# EAGLE design GPS_radiologger_v24_L70_CMWX_MAX (EAGLE 9.6.2)
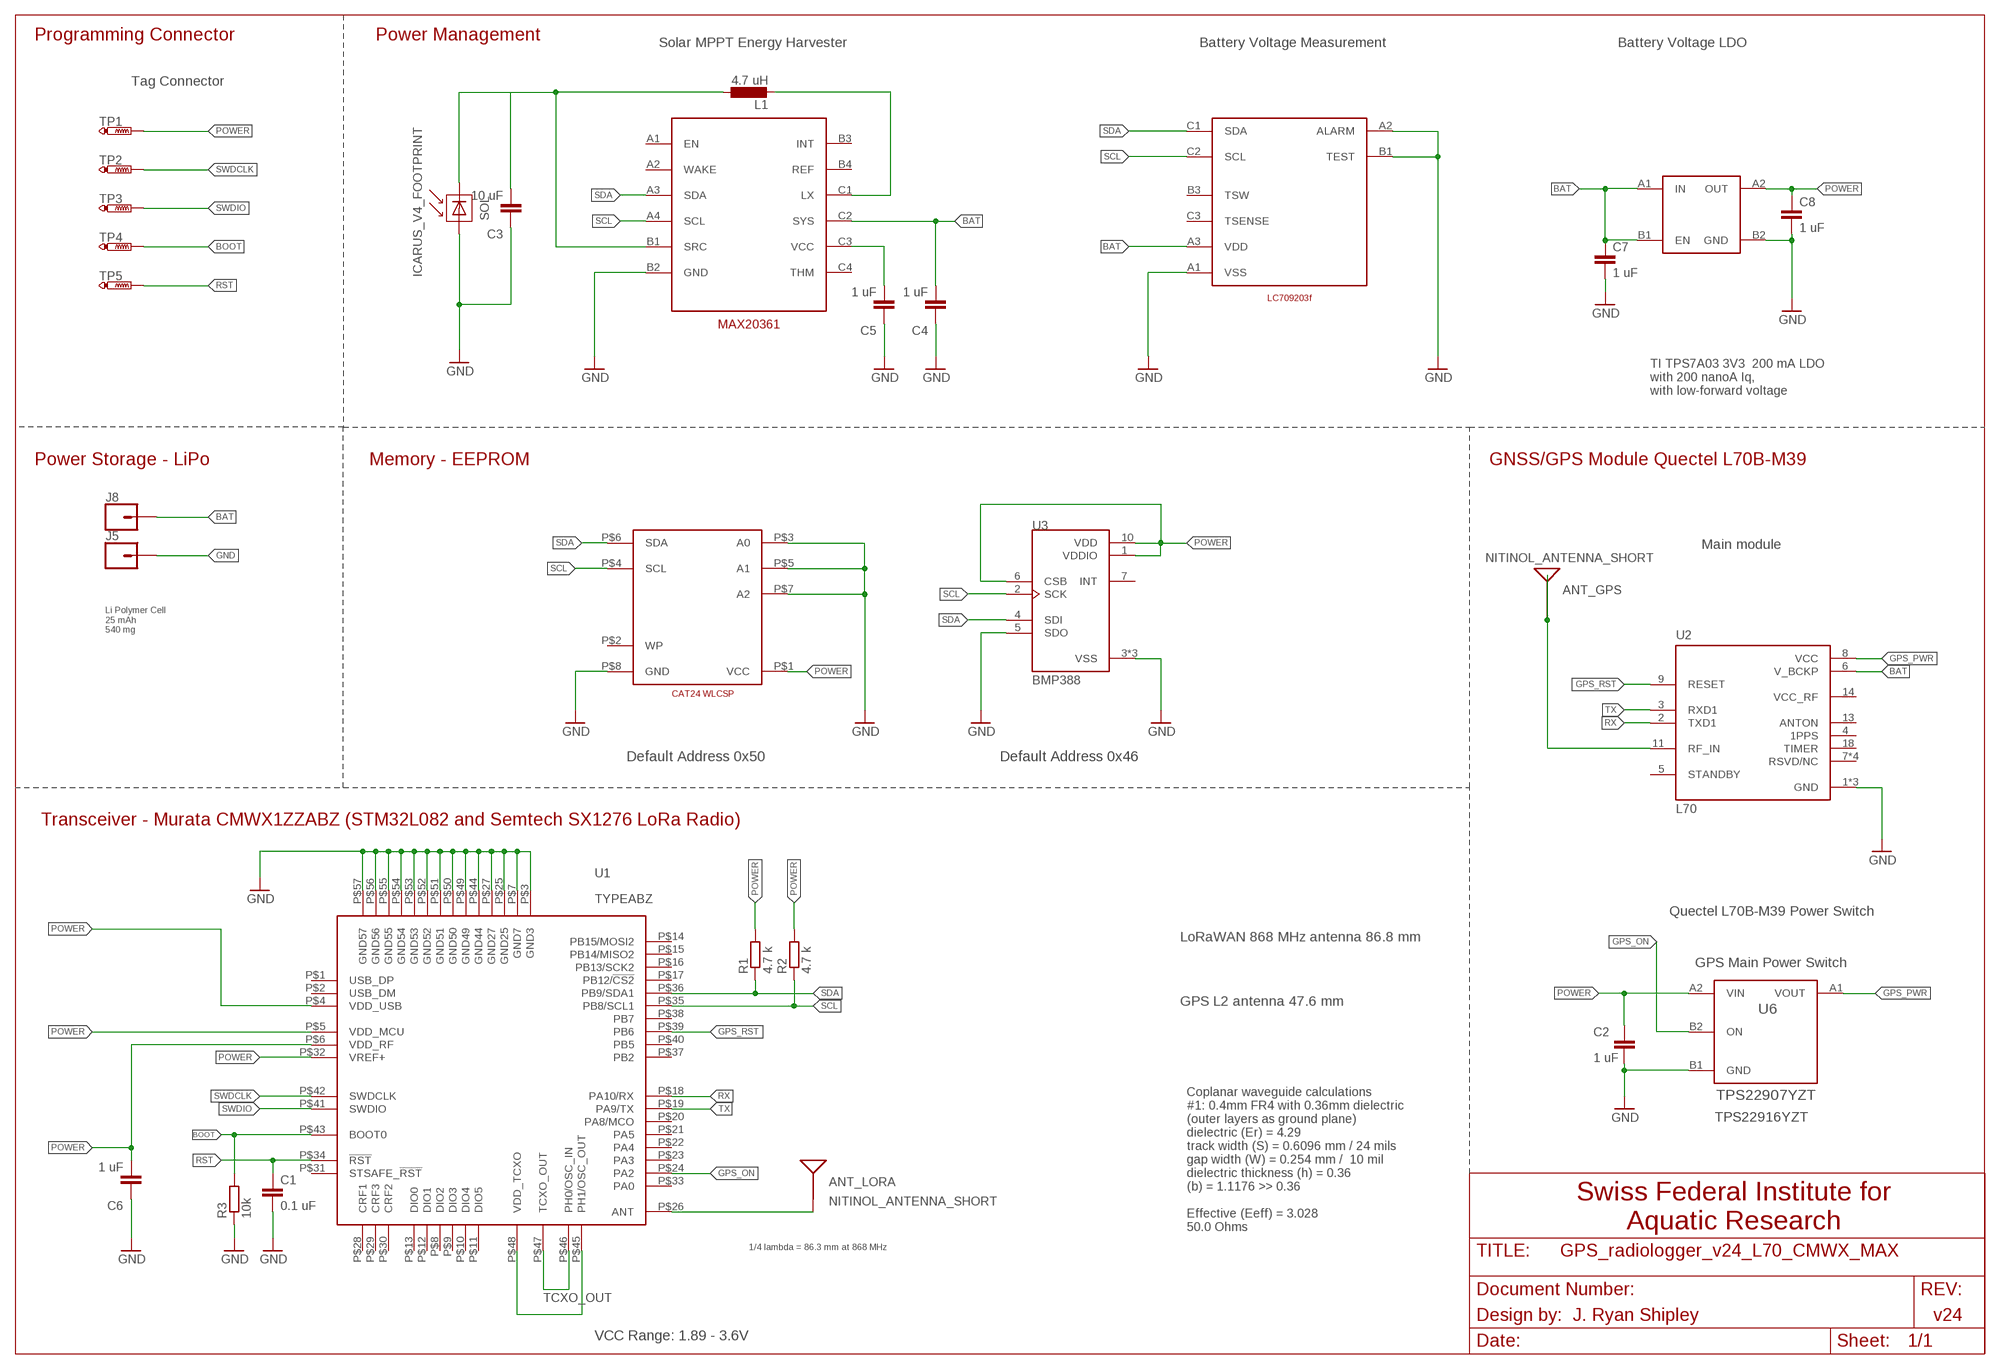
[diagram p0: schematic, sheet 1]

## Parts
ANT_GPS  NITINOL_ANTENNA_SHORT  [ICARUS_NITINOL_ANTENNA_SHORT]
ANT_LORA  NITINOL_ANTENNA_SHORT  [ICARUS_NITINOL_ANTENNA_SHORT]
C1  0.1 uF  C-EUC0201  [C0201]
C2  1 uF  C-EUC0201  [C0201]
C3  10 uF  C-EUC0402  [C0402]
C4  1 uF  C-EUC0201  [C0201]
C5  1 uF  C-EUC0201  [C0201]
C6  1 uF  C-EUC0201  [C0201]
C7  1 uF  0402CAP.KW  [0402-CAP]
C8  1 uF  0402CAP.KW  [0402-CAP]
J5  CONN_01PTH_NO_SILK_SMALL  [1X01_SMALL]
J8  CONN_01PTH_NO_SILK_SMALL  [1X01_SMALL]
L1  4.7 uH  IND_2016  [INDC2016X120L]
R1  4.7 k  R-EU_R0201  [R0201]
R2  4.7 k  R-EU_R0201  [R0201]
R3  10k  R-EU_R0201  [R0201]
SOL  ICARUS_V4_FOOTPRINT  [ICARUS_FULL_FOOTPRINT]
TP1  PTR1TP08SQ  [TP08SQ]
TP2  PTR1TP08SQ  [TP08SQ]
TP3  PTR1TP08SQ  [TP08SQ]
TP4  PTR1TP08SQ  [TP08SQ]
TP5  PTR1TP08SQ  [TP08SQ]
U1  TYPEABZ  [TYPEABZ]
U2  L70  [XCVR_L70]
U3  BMP388  [PQFN50P200X200X80-10N]
U4  TPS7A03-DSBGA  [BGA4N35P2X2_70X70X40N]
U5  LC709203F  [BGA9N50P3X3_160X175X50N]
U6  TPS22907YZT  [YFP0004-DSBGA]
U7  CAT24_WLCSP8  [WLCSP8]
U8  MAX20361  [BGA12N40P4X3_123X163X64N]

## Nets
BAT [battery]: C4.2 C7.1 J8.P$1 U2.6(V_BCKP) U4.A1(IN) U4.B1(EN) U5.A3(VDD) U8.C2(SYS)
BOOT: R3.2 TP4.TP U1.P$43(BOOT0)
GND: C1.2 C2.2 C3.1 C4.1 C5.1 C6.1 C7.2 C8.2 J5.P$1 R3.1 SOL.P$2(MINUS) U1.P$3(GND3) U1.P$7(GND7) U1.P$25(GND25) U1.P$27(GND27) U1.P$44(GND44) U1.P$49(GND49) U1.P$50(GND50) U1.P$51(GND51) U1.P$52(GND52) U1.P$53(GND53) U1.P$54(GND54) U1.P$55(GND55) U1.P$56(GND56) U1.P$57(GND57) U2.1(GND) U2.10(GND) U2.12(GND) U3.3(VSS) U3.5(SDO) U3.8(VSS) U3.9(VSS) U4.B2(GND) U5.A1(VSS) U5.A2(ALARM) U5.B1(TEST) U6.B1(GND) U7.P$3(A0) U7.P$5(A1) U7.P$7(A2) U7.P$8(GND) U8.B2(GND)
GPS_ON: U1.P$24(PA2) U6.B2(ON)
GPS_PWR: U2.8(VCC) U6.A1(VOUT)
GPS_RST: U1.P$39(PB6) U2.9(RESET)
N$1: U1.P$45(PH1/OSC_OUT) U1.P$48(VDD_TCXO)
N$2 [antenna]: ANT_GPS.1(SIGNAL) ANT_GPS.2(SIGNAL) ANT_GPS.3(SIGNAL) U2.11(RF_IN)
N$3: L1.2 U8.C1(LX)
N$4: C5.2 U8.C3(VCC)
N$11 [antenna]: ANT_LORA.1(SIGNAL) ANT_LORA.2(SIGNAL) ANT_LORA.3(SIGNAL) U1.P$26(ANT)
N$15 [battery]: C3.2 L1.1 SOL.P$1(PLUS) U8.B1(SRC)
POWER [power]: C2.1 C6.2 C8.1 R1.2 R2.2 TP1.TP U1.P$4(VDD_USB) U1.P$5(VDD_MCU) U1.P$6(VDD_RF) U1.P$32(VREF+) U3.1(VDDIO) U3.6(CSB) U3.10(VDD) U4.A2(OUT) U6.A2(VIN) U7.P$1(VCC)
RST: C1.1 TP5.TP U1.P$34(!RST)
RX: U1.P$18(PA10/RX) U2.2(TXD1)
SCL: R2.1 U1.P$35(PB8/SCL1) U3.2(SCK) U5.C2(SCL) U7.P$4(SCL) U8.A4(SCL)
SDA: R1.1 U1.P$36(PB9/SDA1) U3.4(SDI) U5.C1(SDA) U7.P$6(SDA) U8.A3(SDA)
SWDCLK: TP2.TP U1.P$42(SWDCLK)
SWDIO: TP3.TP U1.P$41(SWDIO)
TCXO_OUT: U1.P$46(PH0/OSC_IN) U1.P$47(TCXO_OUT)
TX: U1.P$19(PA9/TX) U2.3(RXD1)
Unconnected: U1.P$1(USB_DP) U1.P$2(USB_DM) U1.P$8(DIO2) U1.P$9(DIO3) U1.P$10(DIO4) U1.P$11(DIO5) U1.P$12(DIO1) U1.P$13(DIO0) U1.P$14(PB15/MOSI2) U1.P$15(PB14/MISO2) U1.P$16(PB13/SCK2) U1.P$17(PB12/!CS2) U1.P$20(PA8/MCO) U1.P$21(PA5) U1.P$22(PA4) U1.P$23(PA3) U1.P$28(CRF1) U1.P$29(CRF3) U1.P$30(CRF2) U1.P$31(STSAFE_!RST) U1.P$33(PA0) U1.P$37(PB2) U1.P$38(PB7) U1.P$40(PB5) U2.4(1PPS) U2.5(STANDBY) U2.7(RSVD/NC) U2.13(ANTON) U2.14(VCC_RF) U2.15(RSVD/NC) U2.16(RSVD/NC) U2.17(RSVD/NC) U2.18(TIMER) U3.7(INT) U5.B3(TSW) U5.C3(TSENSE) U7.P$2(WP) U8.A1(EN) U8.A2(WAKE) U8.B3(INT) U8.B4(REF) U8.C4(THM)

## Notes on the sheet
- Programming Connector | Power Management
- Solar MPPT Energy Harvester | Battery Voltage Measurement | Battery Voltage LDO
- Tag Connector
- TI TPS7A03 3V3  200 mA LDO
  with 200 nanoA Iq, 
  with low-forward voltage
- Power Storage - LiPo | Memory - EEPROM | GNSS/GPS Module Quectel L70B-M39
- Main module
- Li Polymer Cell
  25 mAh
  540 mg
- Default Address 0x50 | Default Address 0x46
- Transceiver - Murata CMWX1ZZABZ (STM32L082 and Semtech SX1276 LoRa Radio)
- Quectel L70B-M39 Power Switch
- LoRaWAN 868 MHz antenna 86.8 mm
- GPS Main Power Switch
- GPS L2 antenna 47.6 mm
- TPS22916YZT
- Swiss Federal Institute for
  Aquatic Research
- Coplanar waveguide calculations
  #1: 0.4mm FR4 with 0.36mm dielectric 
  (outer layers as ground plane)
  dielectric (Er) = 4.29
  track width (S) = 0.6096 mm / 24 mils
  gap width (W) = 0.254 mm /  10 mil
  dielectric thickness (h) = 0.36
  (b) = 1.1176 >> 0.36
  
  Effective (Eeff) = 3.028
  50.0 Ohms
- 1/4 lambda = 86.3 mm at 868 MHz
- Design by: | J. Ryan Shipley | v24
- VCC Range: 1.89 - 3.6V

## Library data of the parts
ANT_GPS ANT_LORA = Antenna_mounts:NITINOL_ANTENNA_SHORT
C1-C6 = rcl:C-EU: CAPACITOR, European symbol; SPICEPREFIX: C
C7 C8 = SparkFun-Capacitors:0402CAP.KW
J5 J8 = SparkFun-Connectors:CONN_01: Single connection point. Often used as Generic Header-pin footprint for 0.1 inch spaced/style header connections On any of the 0.1 inch spaced packages, you can populate with these: Break Away Headers - Straight <https://www.sparkfun.com/products/116> (PRT-00116) Break Away Male Headers - Right Angle <https://www.sparkfun.com/products/553> (PRT-00553) Female Headers <https://www.sparkfun.com/products/115> (PRT-00115) Break Away Headers - Machine Pin <https://www.sparkfun.com/products/117> (PRT-00117) Break Away Female Headers - Swiss Machine Pin <https://www.sparkfun.com/products/743> (PRT-00743) This device is also useful as a general connection point to wire up your design to another part of your project. Our various solder wires solder well into these plated through hole pads. Hook-Up Wire - Assortment (Stranded, 22 AWG) <https://www.sparkfun.com/products/11375> (PRT-11375) Hook-Up Wire - Assortment (Solid Core, 22 AWG) <https://www.sparkfun.com/products/11367> (PRT-11367) View the entire wire category on our website here <https://www.sparkfun.com/categories/141> Special notes: SMTSO-256-ET is a "flush mount" nut for a 4-40 screw. We mostly use this on specialty testbeds; it is a nice way to connect hardware to your PCB at an adjustable hieght. Also note, the SNAP packages are for using a snappable style connector. We sell a baggie of snaps and they are also used on two LilyPad designs: Snap Assortment - 30 pack (male and female) <https://www.sparkfun.com/products/11347> (DEV-11347) LilyPad Arduino SimpleSnap <https://www.sparkfun.com/products/10941> (DEV-10941) LilyPad SimpleSnap Protoboard <https://www.sparkfun.com/products/10940> (DEV-10940)
L1 = Ryan_custom:IND_2016
R1-R3 = rcl:R-EU_: RESISTOR, European symbol; SPICEPREFIX: R
SOL = TrisolX_Solar_Cells:ICARUS_V4_FOOTPRINT
TP1-TP5 = testpad:PTR1: TEST PIN
U1 = Kris:TYPEABZ: CMWX1ZZABZ-078
U2 = L70:L70: GPS Module Check prices <https://pricing.snapeda.com/parts/L70/Quectel/view-part?ref=eda>; AVAILABILITY: Warning; DESCRIPTION: L70, an SMD type module, brings the high performance of MTK positioning engine to the industrial applications with compact profile, ultra low power consumption and fast positioning capability.; MF: Quectel; MP: L70; PACKAGE: 2920 Quectel; PRICE: None
U3 = BMP388:BMP388: P-Sensor SPI I2C 1, 25 Bar SMD; AVAILABILITY: Unavailable; DESCRIPTION: Pressure Sensor 4.35PSI ~ 18.13PSI (30kPa ~ 125kPa) Absolute 10-WFLGA; MF: Bosch Sensortec; MP: BMP388; PACKAGE: WFLGA-10 Bosch Tools; PRICE: None
U4 = Ryan_custom:TPS7A03-DSBGA
U5 = Ryan_custom:LC709203F
U6 = TPS22916:TPS22907YZT
U7 = Ryan_custom:CAT24_WLCSP8
U8 = Ryan_custom:MAX20361

## Net classes
1 power: width 0.305 mm
2 antenna: width 0.61 mm, clearance 0.254 mm
3 battery: width 0.254 mm
4 diff_pair: width 0.178 mm, clearance 0.152 mm

## Board
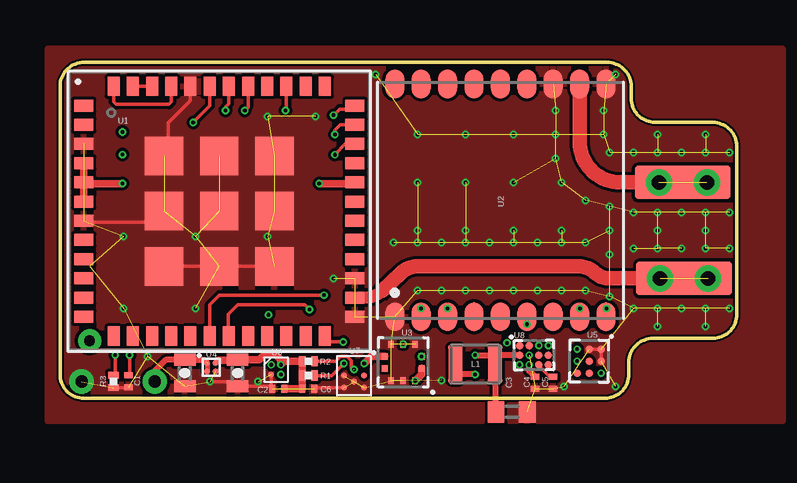
[diagram p1: board, top side]
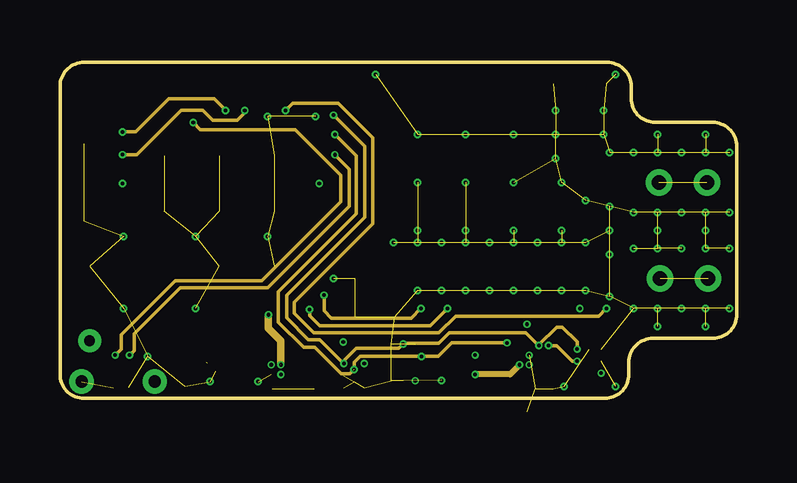
[diagram p2: board, inner layer Route2]
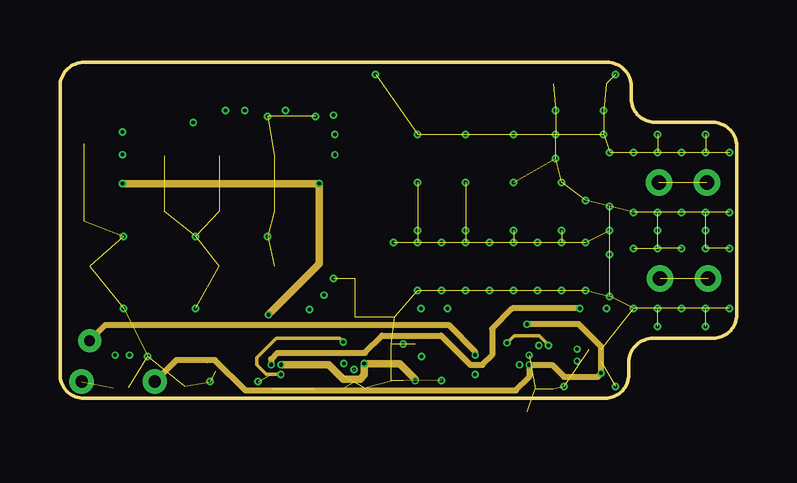
[diagram p3: board, inner layer Route15]
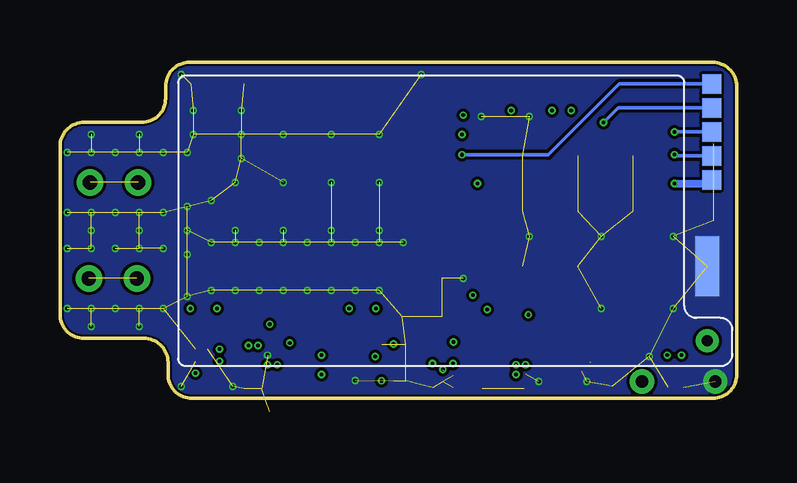
[diagram p4: board, bottom side, seen from below]

Size 28.2 x 14 mm. Coordinates in mm from the lower left corner, seen from the top.
Outline: 1,14 22.8,14 arc-90 23.8,13 23.8,12.5 arc90 24.8,11.5 27.2,11.5 arc-90 28.2,10.5 28.2,3.5 arc-90 27.2,2.5 24.7,2.5 arc90 23.7,1.5 23.7,1 arc-90 22.7,0 1,0 arc-90 0,1 0,13 arc-90 1,14
Copper layers (1*2+15*16): Top 0.035mm / dielectric 0.08mm / Route2 0.035mm / dielectric 0.08mm / Route15 0.035mm / dielectric 0.11mm / Bottom 0.035mm
Design rules "default *": minimum track width 5mil, minimum drill 0.15mm, track to track 5mil, track to pad 3mil, pad to pad 3mil, via to via 3mil, smd to smd 3mil, copper to edge 3mil, drill to drill 3mil, minimum pad ring 10mil, minimum via ring 3mil, stop-mask expansion 0mil, vias tented up to drill 20mil, thermal gap 0mil

### Footprints (pad centres in the part's own frame; a part is rotated, then mirrored left to right if it is on the bottom)
ICARUS_NITINOL_ANTENNA_SHORT = smd 4 x 1.4: 1 0,0 | drill 0.6: 2 -1,0; 3 1,0
C0201 = smd 0.25 x 0.35: 1 -0.25,0; 2 0.25,0
C0402 = smd 0.7 x 0.9: 1 -0.65,0; 2 0.65,0
0402-CAP = smd 0.5 x 0.9: 1 -0.55,0; 2 0.55,0
1X01_SMALL = drill 0.508: P$1 0,0
INDC2016X120L = smd 0.6 x 1.612: 1 -0.825,0; 2 0.825,0
R0201 = smd 0.28 x 0.43: 1 -0.255,0; 2 0.255,0
ICARUS_FULL_FOOTPRINT = drill 0.45: P$1 5,11.5 | smd 2.5 x 1: P$2 1.9,11.5
TP08SQ = smd 0.8 x 0.8: TP 0,0
TYPEABZ = smd 0.8 x 0.5: P$1 -5.65,4.4; P$2 -5.65,3.6; P$3 -5.65,2.8; P$4 -5.65,2; P$5 -5.65,1.2; P$6 -5.65,0.4; P$7 -5.65,-0.4; P$8 -5.65,-1.2; P$9 -5.65,-2; P$10 -5.65,-2.8; P$11 -5.65,-3.6; P$12 -5.65,-4.4; P$25 5.65,-4.4; P$26 5.65,-3.6; P$27 5.65,-2.8; P$28 5.65,-2; P$29 5.65,-1.2; P$30 5.65,-0.4; P$31 5.65,0.4; P$32 5.65,1.2; P$33 5.65,2; P$34 5.65,2.8; P$35 5.65,3.6; P$36 5.65,4.4 | smd 0.5 x 0.8: P$13 -4.4,-5.2; P$14 -3.6,-5.2; P$15 -2.8,-5.2; P$16 -2,-5.2; P$17 -1.2,-5.2; P$18 -0.4,-5.2; P$19 0.4,-5.2; P$20 1.2,-5.2; P$21 2,-5.2; P$22 2.8,-5.2; P$23 3.6,-5.2; P$24 4.4,-5.2; P$37 4.4,5.2; P$38 3.6,5.2; P$39 2.8,5.2; P$40 2,5.2; P$41 1.2,5.2; P$42 0.4,5.2; P$43 -0.4,5.2; P$44 -1.2,5.2; P$45 -2,5.2; P$46 -2.8,5.2; P$47 -3.6,5.2; P$48 -4.4,5.2 | smd 1.6 x 1.6: P$49 -2.3,2.3; P$50 0,2.3; P$51 2.3,2.3; P$52 -2.3,0; P$53 0,0; P$54 2.3,0; P$55 -2.3,-2.3; P$56 0,-2.3; P$57 2.3,-2.3
XCVR_L70 = smd 1.2 x 0.8: 1 -4.85,4.4; 2 -4.85,3.3; 3 -4.85,2.2; 4 -4.85,1.1; 5 -4.85,0; 6 -4.85,-1.1; 7 -4.85,-2.2; 8 -4.85,-3.3; 9 -4.85,-4.4; 10 4.85,-4.4; 11 4.85,-3.3; 12 4.85,-2.2; 13 4.85,-1.1; 14 4.85,0; 15 4.85,1.1; 16 4.85,2.2; 17 4.85,3.3; 18 4.85,4.4
PQFN50P200X200X80-10N = smd 0.275 x 0.25: 1 -0.765,0.25; 2 -0.765,-0.25; 6 0.765,-0.25; 7 0.765,0.25 | smd 0.25 x 0.275: 3 -0.5,-0.765; 4 0,-0.765; 5 0.5,-0.765; 8 0.5,0.765; 9 0,0.765 | smd 0.255 x 0.275: 10 -0.5,0.765
BGA4N35P2X2_70X70X40N = smd 0.26 x 0.26: A1 -0.175,0.175; A2 0.175,0.175; B1 -0.175,-0.175; B2 0.175,-0.175
BGA9N50P3X3_160X175X50N = smd 0.32 x 0.32: A1 -0.5,0.5; A2 0,0.5; A3 0.5,0.5; B1 -0.5,0; B2 0,0; B3 0.5,0; C1 -0.5,-0.5; C2 0,-0.5; C3 0.5,-0.5
YFP0004-DSBGA = smd 0.25 x 0.25: A1 0.2,-0.2; A2 -0.2,-0.2; B1 0.2,0.2; B2 -0.2,0.2
WLCSP8 = smd 0.24 x 0.24: P$1 -0.5,0.425; P$2 0,0.425; P$3 0.5,0.425; P$4 -0.25,0; P$5 0.25,0; P$6 -0.5,-0.425; P$7 0,-0.425; P$8 0.5,-0.425
BGA12N40P4X3_123X163X64N = smd 0.32 x 0.32: A1 -0.6,0.4; A2 -0.2,0.4; A3 0.2,0.4; A4 0.6,0.4; B1 -0.6,0; B2 -0.2,0; B3 0.2,0; B4 0.6,0; C1 -0.6,-0.4; C2 -0.2,-0.4; C3 0.2,-0.4; C4 0.6,-0.4

### Placement (x,y rotation side)
ANT_GPS  25.95,9 180 top
ANT_LORA  26,5 0 top
C1  2.85,0.71 270 top
C2  9.1,0.4 180 top
C3  18.82,-0.56 180 top
C4  19.8,0.65 90 top
C5  20.55,0.65 90 top
C6  10.35,0.4 180 top
C7  5.2,1.05 270 top
C8  7.4,1.05 270 top
J5  0.9,0.7 0 top
J8  3.95,0.7 180 top
L1  17.3,1.43 180 top
R1  10.35,0.95 180 top
R2  10.35,1.55 180 top
R3  2.23,0.7 90 top
SOL  12.73,7.4 270 bottom
TP1  1.05,9.1 0 bottom
TP2  1.05,11.1 0 bottom
TP3  1.05,10.1 0 bottom
TP4  1.05,12.1 0 bottom
TP5  1.05,13.1 0 bottom
U1  6.64,7.8 0 top
U2  18.35,8.25 90 top
U3  14.3,1.5 180 top
U4  6.3,1.3 0 top
U5  22.05,1.55 270 top
U6  9,1.2 180 top
U7  12.25,0.95 270 top
U8  19.75,1.8 0 top

### Tracks (layer width: path | path; a pad name or v marks a point on that pad's centre or on a via)
BAT  (via drill 0.15)  (1 unrouted)
  Top 0.203: U4.A1 U4.B1
  Top 0.254: C4.2 19.55,1.15 U8.C2 | U2.6 v19.45,3.1 v19.46,3.09 | J8.P$1 3.95,1.15 4.4,1.6 C7.1 6.02,1.6 6.1,1.52 6.1,1.5
  Route15 0.254: v19.46,3.09 21.61,3.09 22.55,2.15 U5.A3 22.4,0.9 21,0.9 20.5,1.4 U8.C2 19.54,0.88 18.99,0.33 7.72,0.33 6.46,1.59 4.85,1.59 J8.P$1
  other vias: 22.55,1.05 19.55,1.4
BOOT  (via drill 0.15)
  Top 0.152: U1.P$43 6.24,12.19 v5.55,11.5 | R3.2 2.3,1.03 v2.3,1.8
  Route2 0.152: v5.55,11.5 5.85,11.2 9.8,11.2 11.7,9.3 11.7,8.2 8.4,4.9 4.8,4.9 2.55,2.65 2.55,2.05 v2.3,1.8
  Bottom 0.152: TP4.TP 4.95,12.1 v5.55,11.5
GND  (via drill 0.15)  (111 unrouted)
  Top 0.152: U1.P$55 U1.P$56 U1.P$57 8.94,5.11 | U1.P$7 1.04,7.35 3.92,7.35 4.07,7.5 4.07,7.54 U1.P$52 | U1.P$44 5.44,12.39 4.52,11.48 4.52,10.28 U1.P$49 | U5.B1 U5.A1 U5.A2 | v6.25,0.7 7.2,0.7 C8.2 8.8,0.5 | C2.2 8.8,0.4 8.8,0.5 | C6.1 10.65,0.45 U7.P$8 | U6.B1 8.8,0.5 | C1.2 2.84,0.45 R3.1
  other vias: 19.55,1.8 24.9,7 26.9,7 22.9,7 20.9,7 18.9,7 16.9,7 14.9,7 14.9,9 16.9,9 18.9,9 20.9,9 18.9,11 16.9,11 14.9,11 26.9,11 24.9,11 22.65,11 26.9,3 24.9,3 16.9,6.5 15.9,6.5 14.9,6.5 17.9,6.5 18.9,6.5 19.9,6.5 20.9,6.5 21.9,6.5 22.9,6 15.9,4.5 16.9,4.5 17.9,4.5 18.9,4.5 19.9,4.5 20.9,4.5 14.9,4.5 13.9,6.5 23.9,6.25 24.9,6.25 25.9,6.25 26.9,6.25 26.9,3.75 25.9,3.75 24.9,3.75 23.9,3.75 26.9,7.75 25.9,7.75 24.9,7.75 23.9,7.75 25.9,10.25 26.9,10.25 24.9,10.25 23.9,10.25 20.65,11 20.65,10 21.9,8.25 22.9,8 22.9,10.25 22.65,12 20.65,12 13.15,13.5 23.15,0.5 23.15,13.5 21,0.5 15.9,0.75 2.65,6.75 2.65,3.75 5.65,3.75 5.65,6.75 8.65,6.75 8.65,11.75 10.65,11.75 3.65,1.75 11.4,5 8.25,0.7 21.9,4.5 22.9,4.25 27.9,6.25 27.9,3.75 27.9,7.75 27.9,10.25
  pour Top: -0.51,14.58 30.11,14.58 30.11,-0.96 -0.51,-0.96
  pour Bottom: -0.55,14.7 30.5,14.7 30.5,-1.83 -0.55,-1.83
GPS_ON  (via drill 0.15)
  Top 0.152: U1.P$24 11.29,2.35 v11.8,2.35
  Route15 0.152: U6.B2 8.6,1 8.2,1.4 8.2,1.7 9,2.5 11.65,2.5 v11.8,2.35
  other vias: 9.2,1
GPS_PWR  (via drill 0.15)
  Top 0.254: v21.66,3.75 v21.65,3.75 U2.8
  Route15 0.254: U6.A1 8.8,1.64 9.06,1.9 12.7,1.9 13.42,2.62 15.88,2.62 17.1,1.4 17.6,1.4 18,1.8 18,2.9 18.85,3.75 v21.66,3.75
  other vias: 8.8,1.4
GPS_RST  (via drill 0.15)
  Top 0.152: v9.4,12 9.44,12.04 U1.P$39
  Top 0.203: v22.77,3.75 22.75,3.73 U2.9
  Route2 0.152: v9.4,12 9.7,12.3 11.6,12.3 13.03,10.87 13.03,7.27 9.76,4 9.76,3.54 10.57,2.73 15.78,2.73 16.48,3.43 22.45,3.43 v22.77,3.75
N$1
  Top 0.152: U1.P$45 4.64,12.35 4.54,12.25 2.35,12.25 2.24,12.36 U1.P$48
N$2  (2 unrouted)
  Top 0.61: 21.65,12.95 U2.11 21.65,10.71 arc90 23.36,9 ANT_GPS.1
N$3  (via drill 0.15)
  Top 0.152: L1.2 16.47,1.02
  Top 0.254: v17.3,1 16.5,1 16.47,1.02
  Route2 0.254: U8.C1 18.75,1 v17.3,1
  other vias: 19.15,1.4
N$4
  Top 0.152: U8.C3 20.04,1.31 20.04,1.27 20.4,0.91 C5.2
N$11  (2 unrouted)
  Top 0.508: 13.43,4.48 arc-44 12.73,4.2 U1.P$26
  Top 0.61: ANT_LORA.1 22.91,5 arc-42 22.29,5.24 arc42 21.61,5.5 14.89,5.5 arc44 14.2,5.22 13.43,4.48
N$15  (via drill 0.15)
  Top 0.254: U8.B1 18.12,1.8 | 18.12,1.8 L1.1 18.12,0.9 C3.2 | v17.3,1.8 18.12,1.8
  Route15 0.254: SOL.P$1 1.89,3.06 16.19,3.06 17.3,1.95 v17.3,1.8
POWER  (via drill 0.15)  (1 unrouted)
  Top 0.203: U4.A2 6.59,1.59
  Top 0.305: U1.P$32 12.24,8.95 v10.8,8.95 | C2.1 C6.2 R1.2 R2.2 9.35,1.55 U6.A2 9.2,1.6 8.9,1.9 8.6,1.9 8.3,1.6 C8.1 6.59,1.59 | U3.1 15.06,1 U3.10 | U7.P$1 12.97,1.75 U3.6 | U1.P$4 U1.P$5 | U1.P$5 U1.P$6 | v2.6,8.95 1.04,8.95 U1.P$5
  Route2 0.305: v8.69,3.48 8.69,2.92 9.2,2.4 U6.A2
  Route15 0.305: v8.69,3.48 10.8,5.6 v10.8,8.95 v2.6,8.95 | U3.10 14.8,0.8 14.15,1.45 U7.P$1 12.68,0.97 12.5,0.8 11.8,0.8 11.2,1.4 U6.A2
  Bottom 0.305: v2.6,8.95 1.2,8.95 TP1.TP
  other vias: 9.2,1.4 12.68,1.45 14.8,0.73
RST  (via drill 0.15)
  Top 0.152: U1.P$34 11.89,10.6 v11.44,10.16 v11.45,10.15 | v2.9,1.8 2.9,1 C1.1
  Route2 0.152: v11.45,10.15 12.05,9.55 12.05,8 8.65,4.6 5,4.6 3.09,2.69 3.09,1.99 v2.9,1.8
  Bottom 0.152: TP5.TP 4.9,13.1 7.85,10.15 v11.45,10.15
RX  (via drill 0.15)
  Top 0.152: U1.P$18 6.24,3.9 6.64,4.3 v11,4.3 | U2.2 v15.05,3.75 v15.04,3.75
  Route2 0.152: v11,4.3 11,3.65 11.3,3.35 14.64,3.35 v15.04,3.75
SCL  (via drill 0.15)  (1 unrouted)
  Top 0.152: U1.P$35 11.69,11.4 11.45,11.16 v11.45,11 | 12.22,1.17 12.13,1.26 12.13,1.58 11.95,1.75 11.7,1.75 11.5,1.55 R2.1
  Route2 0.152: v11.45,11 12.35,10.1 12.35,7.7 9.1,4.45 9.1,3.18 10.16,2.12 10.62,2.12 11.72,1.02 12.07,1.02 U7.P$4 12.25,1.5 12.5,1.75 12.8,1.75 v15.06,1.75 15.75,1.75 16.31,2.31 v18.63,2.31 | U5.C2 21.35,1.55 20.7,2.2 U8.A4
  Route15 0.152: v18.63,2.31 18.92,2.6 19.98,2.6 20.25,2.33 20.25,2.3 U8.A4
  other vias: 21.55,1.55 20.35,2.2 12.25,1.2
SDA  (via drill 0.15)
  Top 0.152: U1.P$36 12.14,12.05 11.65,12.05 v11.4,11.8 | R1.1 11.33,0.95 v11.83,1.45
  Route2 0.152: v11.4,11.8 12.7,10.5 12.7,7.55 9.45,4.3 9.45,3.35 10.35,2.45 10.83,2.45 v11.83,1.45 11.83,1.57 12.34,2.08 14.12,2.08 U3.4 14.34,2.3 15.78,2.3 16.21,2.74 19.41,2.74 U8.A3 19.95,2.23 20.69,2.97 20.93,2.97 21.55,2.35 U5.C1
  other vias: 21.55,2.05 19.95,2.2 14.3,2.27
SWDCLK  (via drill 0.15)
  Top 0.152: U1.P$42 7.04,12.29 6.9,12.15 v6.9,12
  Route2 0.152: v6.9,12 6.42,12.48 4.54,12.48 3.16,11.1 v2.6,11.1
  Bottom 0.152: v2.6,11.1 TP2.TP
SWDIO  (via drill 0.15)
  Top 0.152: U1.P$41 7.84,12.14 v7.7,12
  Route2 0.152: v7.7,12 7.7,11.89 7.39,11.58 6.36,11.58 5.94,12 5.05,12 3.21,10.15 v2.6,10.15
  Bottom 0.152: v2.6,10.15 2.54,10.1 TP3.TP
TCXO_OUT
  Top 0.152: U1.P$46 U1.P$47
TX  (via drill 0.15)
  Top 0.152: U2.3 v16.15,3.75 | U1.P$19 7,2.64 7,3.5 7.4,3.9 10.2,3.9 v10.4,3.7
  Route2 0.152: v10.4,3.7 10.4,3.45 10.82,3.03 15.43,3.03 v16.15,3.75

### Text on the board
tNames: U1 | U2 | U3 | U8 | U5 | U4 | U6 | R2 | U7 | R3 | C1 | C7 | C8 | C6 | R1 | L1 | C2 | C3 | C4 | C5